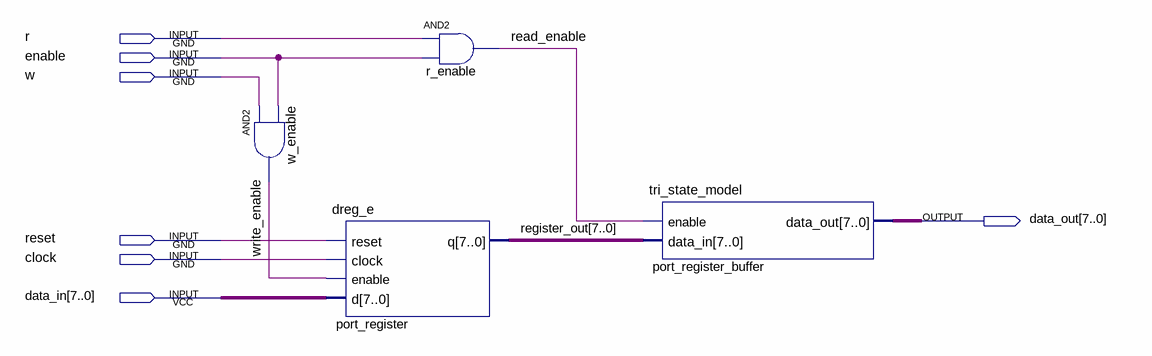
[diagram p0: schematic sheet]
// Quartus schematic simple_cpu.bdf as structural Verilog: 4 symbols, 7 pins
module simple_cpu (
  input  r,
  input  enable,
  input  w,
  input  reset,
  input  clock,
  input  [7:0] data_in,
  output [7:0] data_out
);

  wire read_enable, write_enable;
  wire [7:0] register_out;

  and w_enable (write_enable, w, enable);
  dreg_e port_register (.reset(reset), .clock(clock), .enable(write_enable), .d(data_in), .q(register_out));
  and r_enable (read_enable, r, enable);
  tri_state_model port_register_buffer (.enable(read_enable), .data_in(register_out), .data_out(data_out));
endmodule
